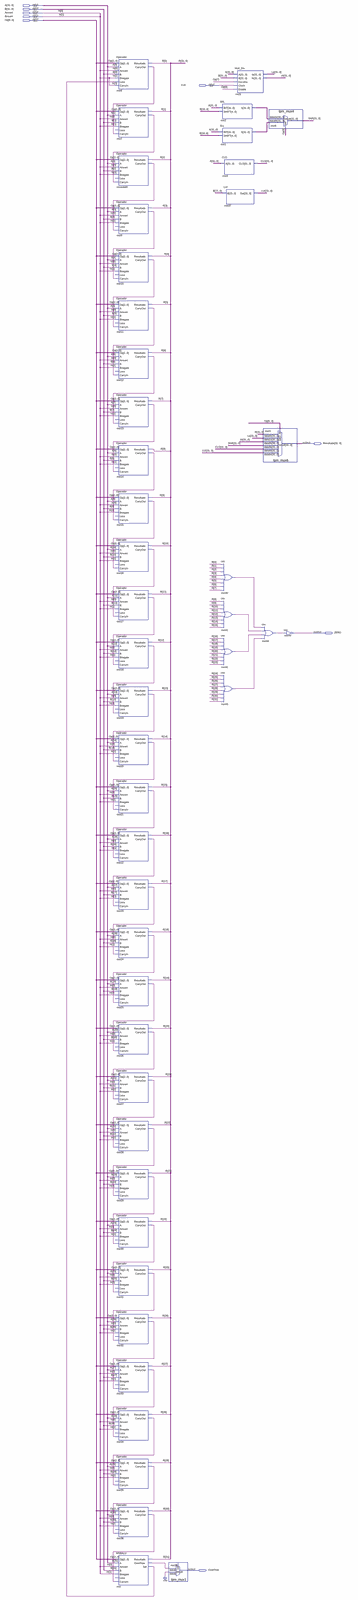
[diagram p0: schematic sheet, whole]
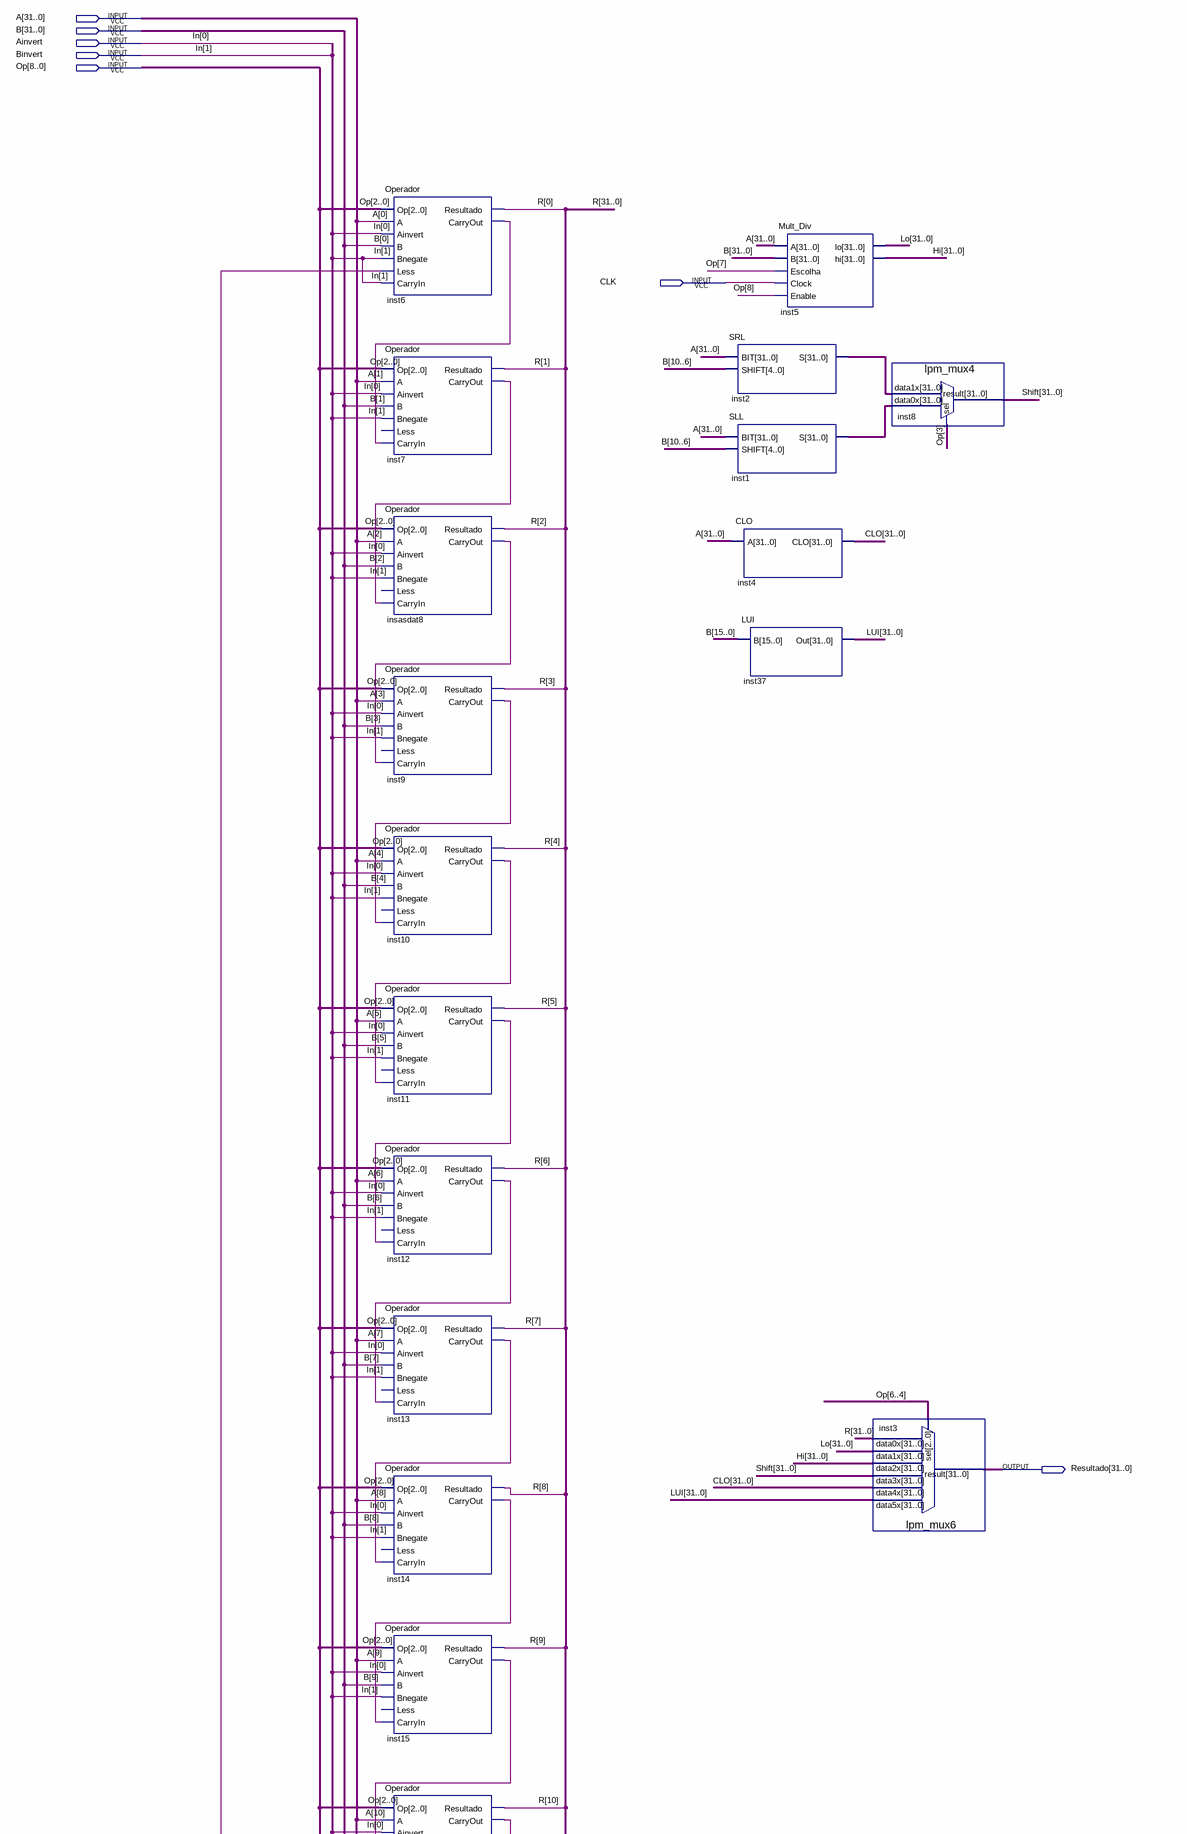
[diagram p1: schematic sheet, upper part]
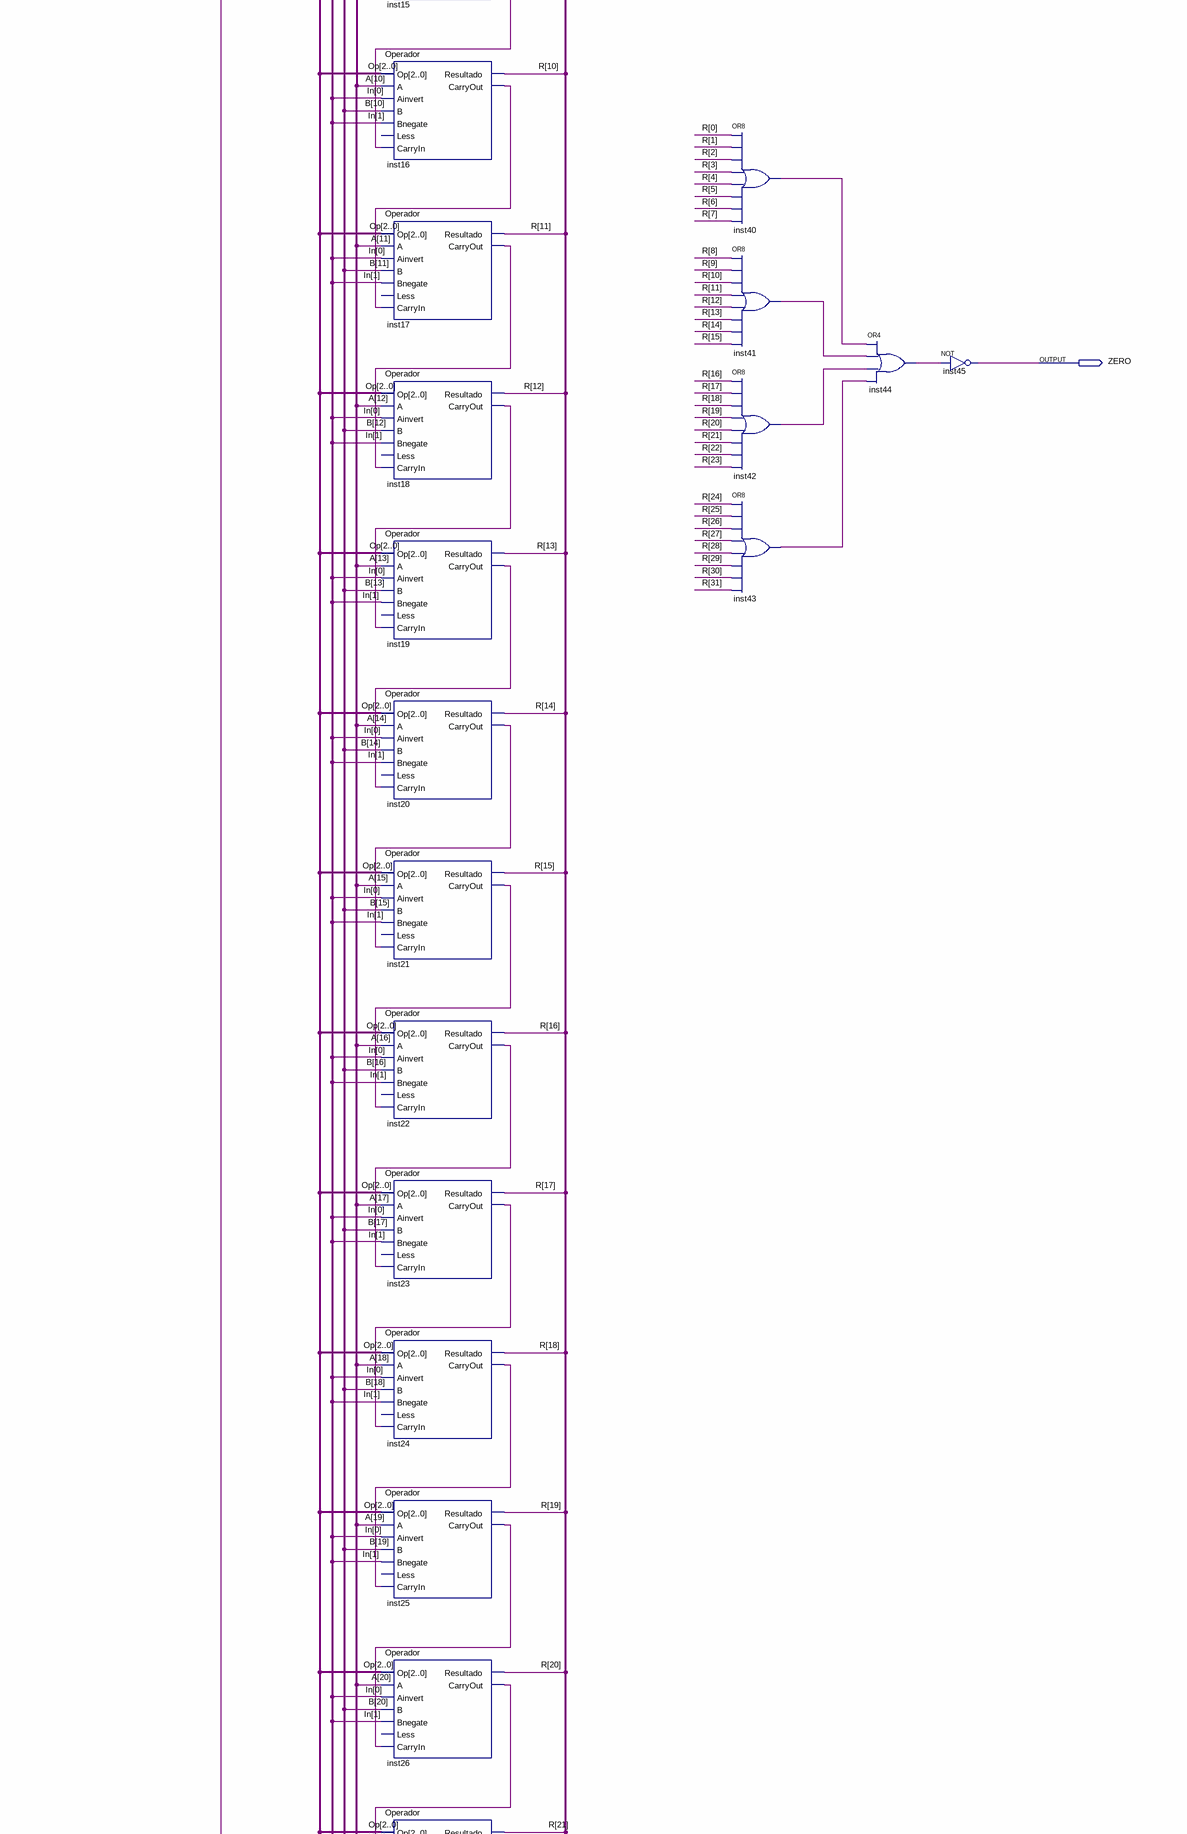
[diagram p2: schematic sheet, middle part]
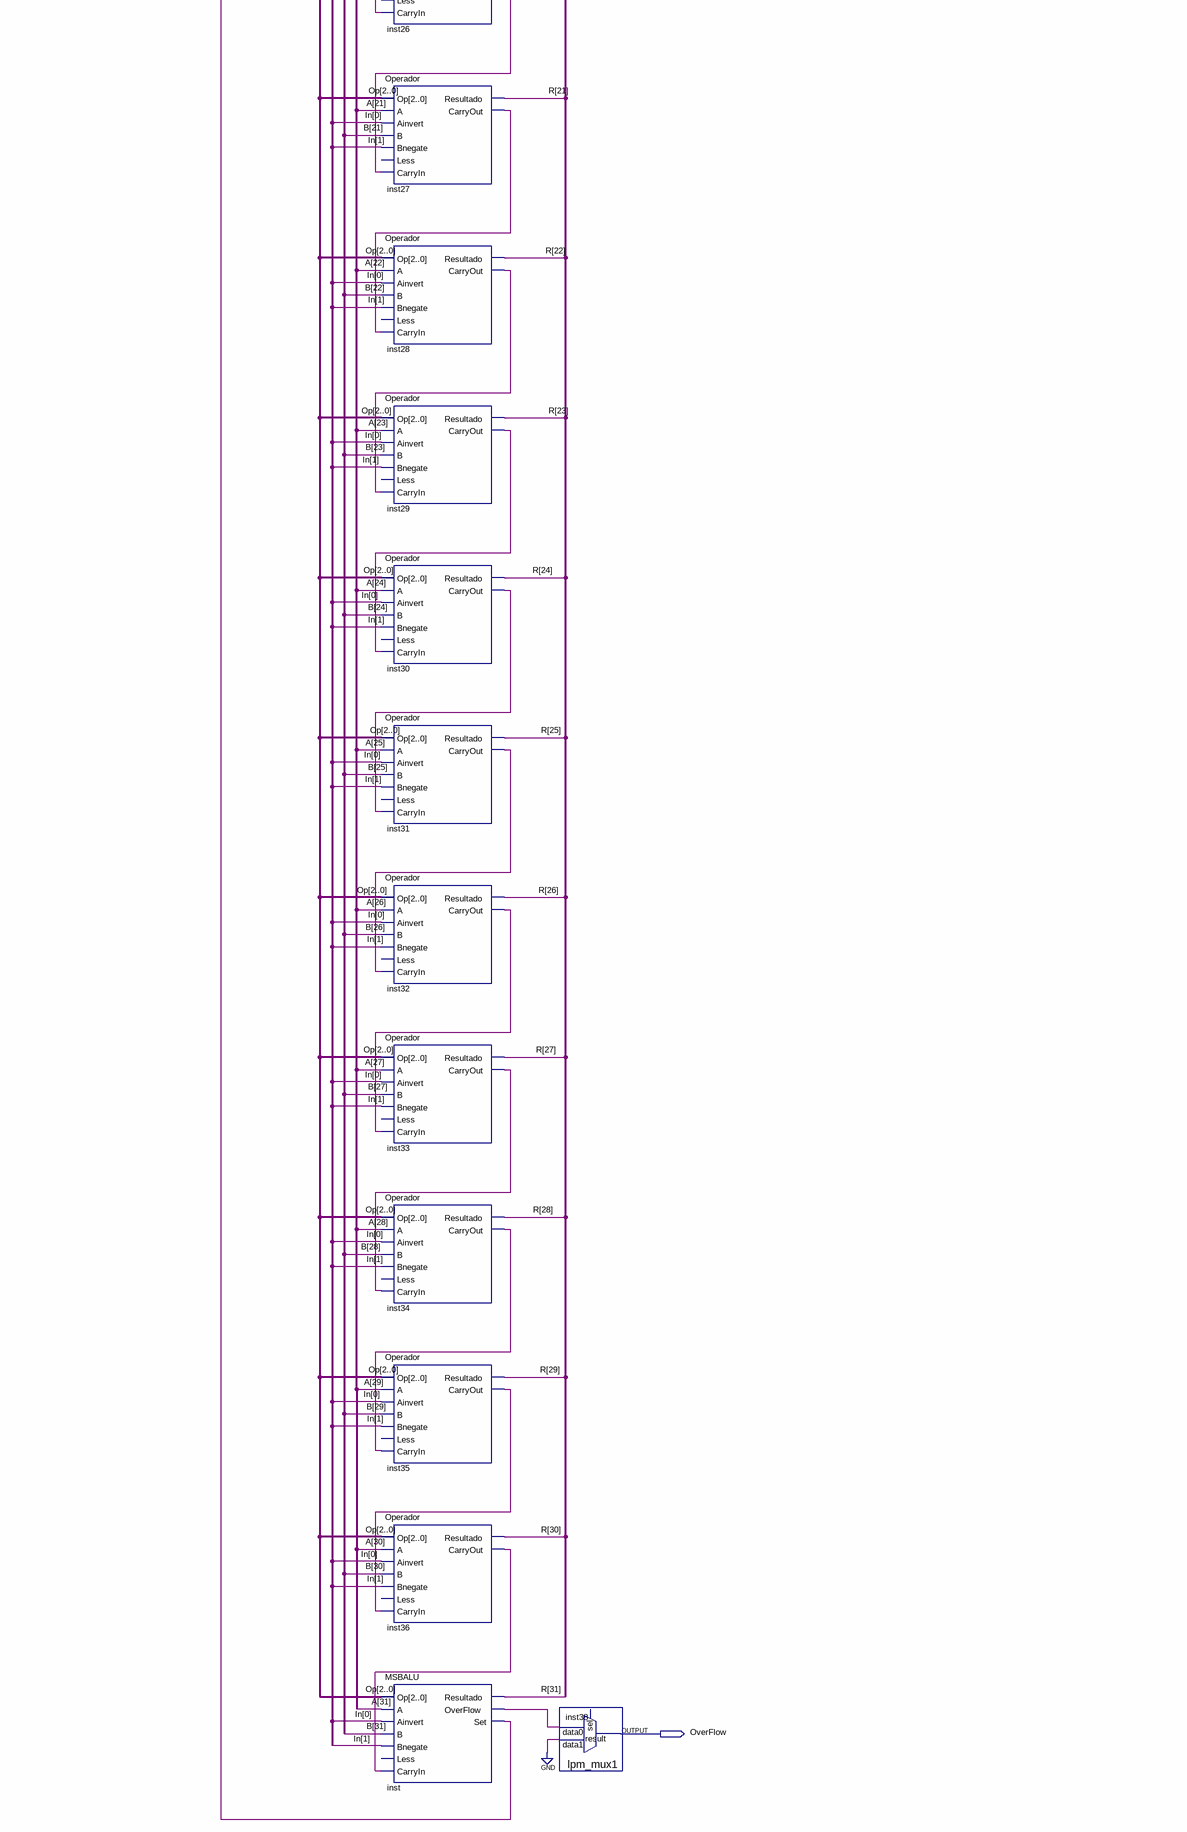
[diagram p3: schematic sheet, lower part]
// Quartus schematic ALU.bdf as structural Verilog: 46 symbols, 9 pins
module ALU (
  input  [31:0] A,
  input  [31:0] B,
  input  Ainvert,
  input  Binvert,
  input  [8:0] Op,
  input  CLK,
  output [31:0] Resultado,
  output ZERO,
  output OverFlow
);

  wire insasdat8_carryout, inst6_carryout, inst7_carryout, inst9_carryout, inst10_carryout, inst11_carryout,
       inst12_carryout, inst13_carryout, inst14_carryout, inst15_carryout, inst16_carryout, inst17_carryout,
       inst18_carryout, inst19_carryout, inst20_carryout, inst21_carryout, inst22_carryout, inst23_carryout,
       inst24_carryout, inst25_carryout, inst26_carryout, inst27_carryout, inst28_carryout, inst29_carryout,
       inst30_carryout, inst31_carryout, inst32_carryout, inst33_carryout, inst34_carryout, inst35_carryout,
       inst36_carryout, inst40_out, inst41_out, inst42_out, inst43_out, inst44_out, inst_overflow, inst_set;
  wire [31:0] CLO, Hi, inst1_s, inst2_s, Lo, LUI, R, Shift;

  Operador inst6 (
    .Op(Op[2:0]), .A(A[0]), .Ainvert(Ainvert), .B(B[0]), .Bnegate(Binvert), .Less(inst_set),
    .CarryIn(Binvert), .Resultado(R[0]), .CarryOut(inst6_carryout));
  Operador inst7 (
    .Op(Op[2:0]), .A(A[1]), .Ainvert(Ainvert), .B(B[1]), .Bnegate(Binvert), .CarryIn(inst6_carryout),
    .Resultado(R[1]), .CarryOut(inst7_carryout));  // open: Less
  Operador insasdat8 (
    .Op(Op[2:0]), .A(A[2]), .Ainvert(Ainvert), .B(B[2]), .Bnegate(Binvert), .CarryIn(inst7_carryout),
    .Resultado(R[2]), .CarryOut(insasdat8_carryout));  // open: Less
  Operador inst9 (
    .Op(Op[2:0]), .A(A[3]), .Ainvert(Ainvert), .B(B[3]), .Bnegate(Binvert), .CarryIn(insasdat8_carryout),
    .Resultado(R[3]), .CarryOut(inst9_carryout));  // open: Less
  Operador inst10 (
    .Op(Op[2:0]), .A(A[4]), .Ainvert(Ainvert), .B(B[4]), .Bnegate(Binvert), .CarryIn(inst9_carryout),
    .Resultado(R[4]), .CarryOut(inst10_carryout));  // open: Less
  Operador inst11 (
    .Op(Op[2:0]), .A(A[5]), .Ainvert(Ainvert), .B(B[5]), .Bnegate(Binvert), .CarryIn(inst10_carryout),
    .Resultado(R[5]), .CarryOut(inst11_carryout));  // open: Less
  Operador inst12 (
    .Op(Op[2:0]), .A(A[6]), .Ainvert(Ainvert), .B(B[6]), .Bnegate(Binvert), .CarryIn(inst11_carryout),
    .Resultado(R[6]), .CarryOut(inst12_carryout));  // open: Less
  Operador inst13 (
    .Op(Op[2:0]), .A(A[7]), .Ainvert(Ainvert), .B(B[7]), .Bnegate(Binvert), .CarryIn(inst12_carryout),
    .Resultado(R[7]), .CarryOut(inst13_carryout));  // open: Less
  Operador inst14 (
    .Op(Op[2:0]), .A(A[8]), .Ainvert(Ainvert), .B(B[8]), .Bnegate(Binvert), .CarryIn(inst13_carryout),
    .Resultado(R[8]), .CarryOut(inst14_carryout));  // open: Less
  Operador inst15 (
    .Op(Op[2:0]), .A(A[9]), .Ainvert(Ainvert), .B(B[9]), .Bnegate(Binvert), .CarryIn(inst14_carryout),
    .Resultado(R[9]), .CarryOut(inst15_carryout));  // open: Less
  Operador inst16 (
    .Op(Op[2:0]), .A(A[10]), .Ainvert(Ainvert), .B(B[10]), .Bnegate(Binvert), .CarryIn(inst15_carryout),
    .Resultado(R[10]), .CarryOut(inst16_carryout));  // open: Less
  Operador inst17 (
    .Op(Op[2:0]), .A(A[11]), .Ainvert(Ainvert), .B(B[11]), .Bnegate(Binvert), .CarryIn(inst16_carryout),
    .Resultado(R[11]), .CarryOut(inst17_carryout));  // open: Less
  Operador inst18 (
    .Op(Op[2:0]), .A(A[12]), .Ainvert(Ainvert), .B(B[12]), .Bnegate(Binvert), .CarryIn(inst17_carryout),
    .Resultado(R[12]), .CarryOut(inst18_carryout));  // open: Less
  Operador inst19 (
    .Op(Op[2:0]), .A(A[13]), .Ainvert(Ainvert), .B(B[13]), .Bnegate(Binvert), .CarryIn(inst18_carryout),
    .Resultado(R[13]), .CarryOut(inst19_carryout));  // open: Less
  Operador inst20 (
    .Op(Op[2:0]), .A(A[14]), .Ainvert(Ainvert), .B(B[14]), .Bnegate(Binvert), .CarryIn(inst19_carryout),
    .Resultado(R[14]), .CarryOut(inst20_carryout));  // open: Less
  Operador inst21 (
    .Op(Op[2:0]), .A(A[15]), .Ainvert(Ainvert), .B(B[15]), .Bnegate(Binvert), .CarryIn(inst20_carryout),
    .Resultado(R[15]), .CarryOut(inst21_carryout));  // open: Less
  Operador inst22 (
    .Op(Op[2:0]), .A(A[16]), .Ainvert(Ainvert), .B(B[16]), .Bnegate(Binvert), .CarryIn(inst21_carryout),
    .Resultado(R[16]), .CarryOut(inst22_carryout));  // open: Less
  Operador inst23 (
    .Op(Op[2:0]), .A(A[17]), .Ainvert(Ainvert), .B(B[17]), .Bnegate(Binvert), .CarryIn(inst22_carryout),
    .Resultado(R[17]), .CarryOut(inst23_carryout));  // open: Less
  Operador inst24 (
    .Op(Op[2:0]), .A(A[18]), .Ainvert(Ainvert), .B(B[18]), .Bnegate(Binvert), .CarryIn(inst23_carryout),
    .Resultado(R[18]), .CarryOut(inst24_carryout));  // open: Less
  Operador inst25 (
    .Op(Op[2:0]), .A(A[19]), .Ainvert(Ainvert), .B(B[19]), .Bnegate(Binvert), .CarryIn(inst24_carryout),
    .Resultado(R[19]), .CarryOut(inst25_carryout));  // open: Less
  Operador inst26 (
    .Op(Op[2:0]), .A(A[20]), .Ainvert(Ainvert), .B(B[20]), .Bnegate(Binvert), .CarryIn(inst25_carryout),
    .Resultado(R[20]), .CarryOut(inst26_carryout));  // open: Less
  Operador inst27 (
    .Op(Op[2:0]), .A(A[21]), .Ainvert(Ainvert), .B(B[21]), .Bnegate(Binvert), .CarryIn(inst26_carryout),
    .Resultado(R[21]), .CarryOut(inst27_carryout));  // open: Less
  Operador inst28 (
    .Op(Op[2:0]), .A(A[22]), .Ainvert(Ainvert), .B(B[22]), .Bnegate(Binvert), .CarryIn(inst27_carryout),
    .Resultado(R[22]), .CarryOut(inst28_carryout));  // open: Less
  Operador inst29 (
    .Op(Op[2:0]), .A(A[23]), .Ainvert(Ainvert), .B(B[23]), .Bnegate(Binvert), .CarryIn(inst28_carryout),
    .Resultado(R[23]), .CarryOut(inst29_carryout));  // open: Less
  Operador inst30 (
    .Op(Op[2:0]), .A(A[24]), .Ainvert(Ainvert), .B(B[24]), .Bnegate(Binvert), .CarryIn(inst29_carryout),
    .Resultado(R[24]), .CarryOut(inst30_carryout));  // open: Less
  Operador inst31 (
    .Op(Op[2:0]), .A(A[25]), .Ainvert(Ainvert), .B(B[25]), .Bnegate(Binvert), .CarryIn(inst30_carryout),
    .Resultado(R[25]), .CarryOut(inst31_carryout));  // open: Less
  Operador inst32 (
    .Op(Op[2:0]), .A(A[26]), .Ainvert(Ainvert), .B(B[26]), .Bnegate(Binvert), .CarryIn(inst31_carryout),
    .Resultado(R[26]), .CarryOut(inst32_carryout));  // open: Less
  Operador inst33 (
    .Op(Op[2:0]), .A(A[27]), .Ainvert(Ainvert), .B(B[27]), .Bnegate(Binvert), .CarryIn(inst32_carryout),
    .Resultado(R[27]), .CarryOut(inst33_carryout));  // open: Less
  Operador inst34 (
    .Op(Op[2:0]), .A(A[28]), .Ainvert(Ainvert), .B(B[28]), .Bnegate(Binvert), .CarryIn(inst33_carryout),
    .Resultado(R[28]), .CarryOut(inst34_carryout));  // open: Less
  Operador inst35 (
    .Op(Op[2:0]), .A(A[29]), .Ainvert(Ainvert), .B(B[29]), .Bnegate(Binvert), .CarryIn(inst34_carryout),
    .Resultado(R[29]), .CarryOut(inst35_carryout));  // open: Less
  Operador inst36 (
    .Op(Op[2:0]), .A(A[30]), .Ainvert(Ainvert), .B(B[30]), .Bnegate(Binvert), .CarryIn(inst35_carryout),
    .Resultado(R[30]), .CarryOut(inst36_carryout));  // open: Less
  MSBALU inst (
    .Op(Op[2:0]), .A(A[31]), .Ainvert(Ainvert), .B(B[31]), .Bnegate(Binvert), .CarryIn(inst36_carryout),
    .Resultado(R[31]), .OverFlow(inst_overflow), .Set(inst_set));  // open: Less
  lpm_mux1 inst38 (.data1(1'b0), .data0(inst_overflow), .result(OverFlow));  // open: sel
  SRL inst2 (.BIT(A), .SHIFT(B[10:6]), .S(inst2_s));
  SLL inst1 (.BIT(A), .SHIFT(B[10:6]), .S(inst1_s));
  CLO inst4 (.A(A), .CLO(CLO));
  or inst40 (inst40_out, R[0], R[1], R[2], R[3], R[4], R[5], R[6], R[7]);
  or inst41 (inst41_out, R[8], R[9], R[10], R[11], R[12], R[13], R[14], R[15]);
  or inst42 (inst42_out, R[16], R[17], R[18], R[19], R[20], R[21], R[22], R[23]);
  or inst43 (inst43_out, R[24], R[25], R[26], R[27], R[28], R[29], R[30], R[31]);
  Mult_Div inst5 (.A(A), .B(B), .Escolha(Op[7]), .Clock(CLK), .Enable(Op[8]), .lo(Lo), .hi(Hi));
  LUI inst37 (.B(B[15:0]), .Out(LUI));
  lpm_mux6 inst3 (
    .data5x(LUI), .data4x(CLO), .data3x(Shift), .data2x(Hi), .data1x(Lo), .data0x(R), .sel(Op[6:4]),
    .result(Resultado));
  or inst44 (inst44_out, inst40_out, inst41_out, inst42_out, inst43_out);
  lpm_mux4 inst8 (.data1x(inst2_s), .data0x(inst1_s), .sel(Op[3]), .result(Shift));
  not inst45 (ZERO, inst44_out);

  // Other names for the same wires on the sheet: In[1:0] = {Binvert, Ainvert}
endmodule
